# Altium schematic sheet Power Distribution - IO Expander.SchDoc: Title
size B; Organization: Midnight Sun Solar Rayce Car Team; Address1: University of Waterloo; Address2: 200 University Ave W; Address3: Waterloo, ON, Canada; Address4: N2L 3E9; Website: www.uwmidsun.com; ProjectName: ProjectName
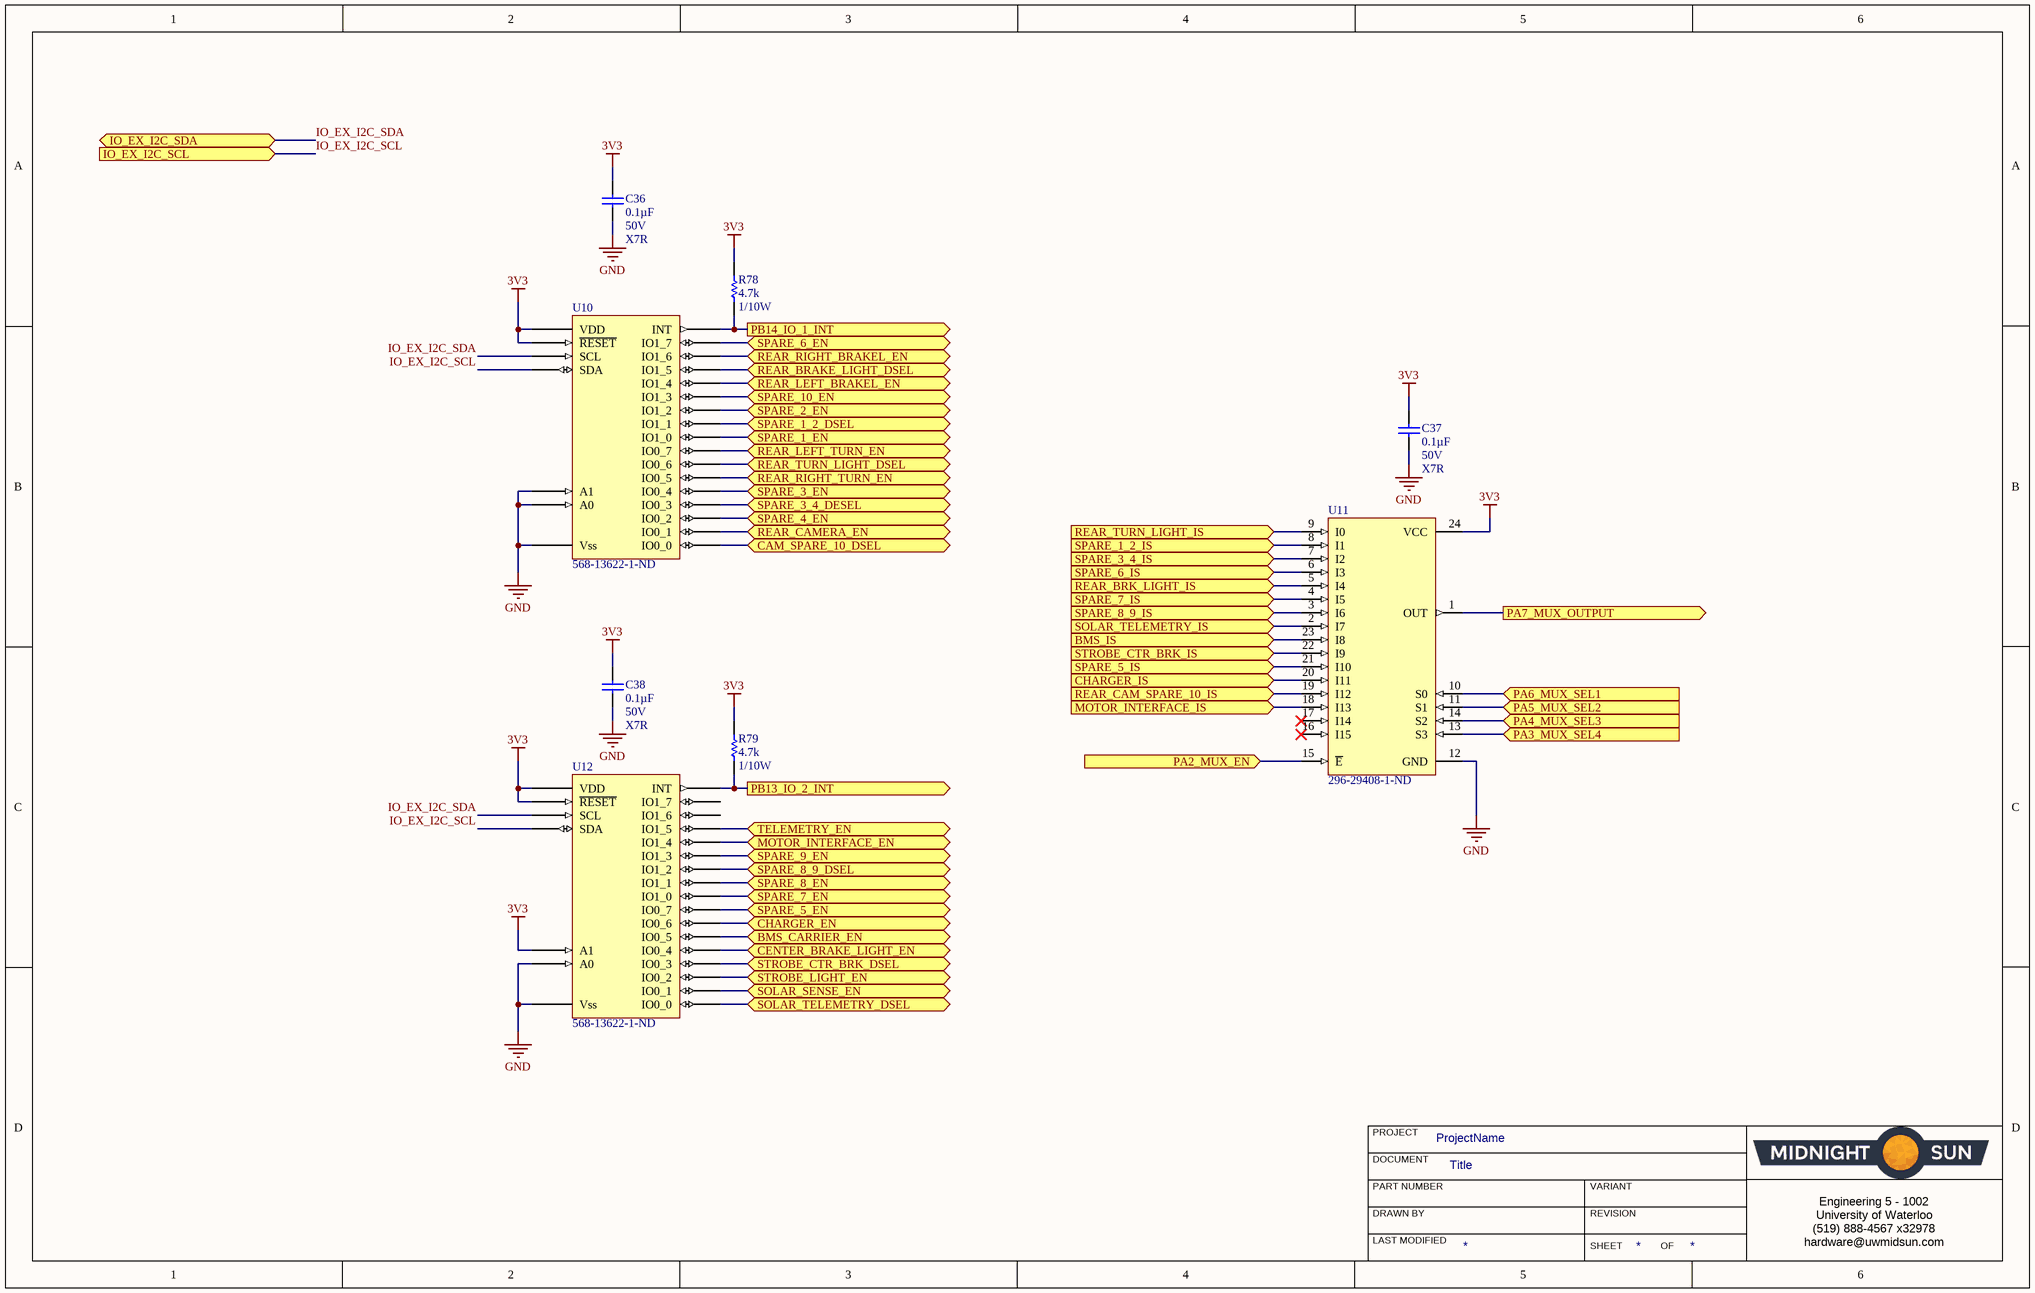
[diagram p0: Power Distribution - IO Expander.SchDoc]

## Parts
C36  Capacitance: 0.1µF  Voltage: 50V  Temperature Coefficient: X7R  [CAP, 0603]  (hidden comment: CAP CER 0.1UF 50V 10% X7R 0603)
C37  Capacitance: 0.1µF  Voltage: 50V  Temperature Coefficient: X7R  [CAP, 0603]  (hidden comment: CAP CER 0.1UF 50V 10% X7R 0603)
C38  Capacitance: 0.1µF  Voltage: 50V  Temperature Coefficient: X7R  [CAP, 0603]  (hidden comment: CAP CER 0.1UF 50V 10% X7R 0603)
R78  Resistance (Ohms): 4.7k  Power (Watts): 1/10W  [RES, 0603]  (hidden comment: RES 4.7K OHM 1% 1/10W 0603)
R79  Resistance (Ohms): 4.7k  Power (Watts): 1/10W  [RES, 0603]  (hidden comment: RES 4.7K OHM 1% 1/10W 0603)
U10  Supplier Part Number 1: 568-13622-1-ND  [SOP127P600-8N]  (hidden comment: 16-BIT I2C-BUS AND SMBUS LOW POW)
U11  Supplier Part Number 1: 296-29408-1-ND  [SOP127P1030X265-24N]  (hidden comment: IC MUX/DEMUX 1X16 24SSOP)
U12  Supplier Part Number 1: 568-13622-1-ND  [SOP127P600-8N]  (hidden comment: 16-BIT I2C-BUS AND SMBUS LOW POW)

## Ports
BMS_CARRIER_EN (bidir), BMS_IS (in), CAM_SPARE_10_DSEL (bidir), CENTER_BRAKE_LIGHT_EN (bidir), CHARGER_EN (bidir), CHARGER_IS (in), IO_EX_I2C_SCL (in), IO_EX_I2C_SDA (bidir), MOTOR_INTERFACE_EN (bidir), MOTOR_INTERFACE_IS (in), PA2_MUX_EN (in), PA3_MUX_SEL4 (in), PA4_MUX_SEL3 (in), PA5_MUX_SEL2 (in), PA6_MUX_SEL1 (in), PA7_MUX_OUTPUT (out), PB13_IO_2_INT (out), PB14_IO_1_INT (out), REAR_BRAKE_LIGHT_DSEL (bidir), REAR_BRK_LIGHT_IS (in), REAR_CAM_SPARE_10_IS (in), REAR_CAMERA_EN (bidir), REAR_LEFT_BRAKEL_EN (bidir), REAR_LEFT_TURN_EN (bidir), REAR_RIGHT_BRAKEL_EN (bidir), REAR_RIGHT_TURN_EN (bidir), REAR_TURN_LIGHT_DSEL (bidir), REAR_TURN_LIGHT_IS (in), SOLAR_SENSE_EN (bidir), SOLAR_TELEMETRY_DSEL (bidir), SOLAR_TELEMETRY_IS (in), SPARE_1_2_DSEL (bidir), SPARE_1_2_IS (in), SPARE_1_EN (bidir), SPARE_2_EN (bidir), SPARE_3_4_DESEL (bidir), SPARE_3_4_IS (in), SPARE_3_EN (bidir), SPARE_4_EN (bidir), SPARE_5_EN (bidir), SPARE_5_IS (in), SPARE_6_EN (bidir), SPARE_6_IS (in), SPARE_7_EN (bidir), SPARE_7_IS (in), SPARE_8_9_DSEL (bidir), SPARE_8_9_IS (in), SPARE_8_EN (bidir), SPARE_9_EN (bidir), SPARE_10_EN (bidir), STROBE_CTR_BRK_DSEL (bidir), STROBE_CTR_BRK_IS (in), STROBE_LIGHT_EN (bidir), TELEMETRY_EN (bidir)

## Nets
3V3: C36.1 C37.1 C38.1 R78.1 R79.1 U10.3(~{RESET}) U10.24(VDD) U11.24(VCC) U12.2(A1) U12.3(~{RESET}) U12.24(VDD)
GND: C36.2 C37.2 C38.2 U10.2(A1) U10.12(Vss) U10.21(A0) U11.12(GND) U12.12(Vss) U12.21(A0)
BMS_CARRIER_EN: U12.9(IO0_5) ; port BMS_CARRIER_EN
BMS_IS: U11.23(I8) ; port BMS_IS
CAM_SPARE_10_DSEL: U10.4(IO0_0) ; port CAM_SPARE_10_DSEL
CENTER_BRAKE_LIGHT_EN: U12.8(IO0_4) ; port CENTER_BRAKE_LIGHT_EN
CHARGER_EN: U12.10(IO0_6) ; port CHARGER_EN
CHARGER_IS: U11.20(I11) ; port CHARGER_IS
IO_EX_I2C_SCL: U10.23(SDA) U12.23(SDA) ; port IO_EX_I2C_SCL
IO_EX_I2C_SDA: U10.22(SCL) U12.22(SCL) ; port IO_EX_I2C_SDA
MOTOR_INTERFACE_EN: U12.17(IO1_4) ; port MOTOR_INTERFACE_EN
MOTOR_INTERFACE_IS: U11.18(I13) ; port MOTOR_INTERFACE_IS
PA2_MUX_EN: U11.15(~{E}) ; port PA2_MUX_EN
PA3_MUX_SEL4: U11.13(S3) ; port PA3_MUX_SEL4
PA4_MUX_SEL3: U11.14(S2) ; port PA4_MUX_SEL3
PA5_MUX_SEL2: U11.11(S1) ; port PA5_MUX_SEL2
PA6_MUX_SEL1: U11.10(S0) ; port PA6_MUX_SEL1
PA7_MUX_OUTPUT: U11.1(OUT) ; port PA7_MUX_OUTPUT
PB13_IO_2_INT: R79.2 U12.1(INT) ; port PB13_IO_2_INT
PB14_IO_1_INT: R78.2 U10.1(INT) ; port PB14_IO_1_INT
REAR_BRAKE_LIGHT_DSEL: U10.18(IO1_5) ; port REAR_BRAKE_LIGHT_DSEL
REAR_BRK_LIGHT_IS: U11.5(I4) ; port REAR_BRK_LIGHT_IS
REAR_CAM_SPARE_10_IS: U11.19(I12) ; port REAR_CAM_SPARE_10_IS
REAR_CAMERA_EN: U10.5(IO0_1) ; port REAR_CAMERA_EN
REAR_LEFT_BRAKEL_EN: U10.17(IO1_4) ; port REAR_LEFT_BRAKEL_EN
REAR_LEFT_TURN_EN: U10.11(IO0_7) ; port REAR_LEFT_TURN_EN
REAR_RIGHT_BRAKEL_EN: U10.19(IO1_6) ; port REAR_RIGHT_BRAKEL_EN
REAR_RIGHT_TURN_EN: U10.9(IO0_5) ; port REAR_RIGHT_TURN_EN
REAR_TURN_LIGHT_DSEL: U10.10(IO0_6) ; port REAR_TURN_LIGHT_DSEL
REAR_TURN_LIGHT_IS: U11.9(I0) ; port REAR_TURN_LIGHT_IS
SOLAR_SENSE_EN: U12.5(IO0_1) ; port SOLAR_SENSE_EN
SOLAR_TELEMETRY_DSEL: U12.4(IO0_0) ; port SOLAR_TELEMETRY_DSEL
SOLAR_TELEMETRY_IS: U11.2(I7) ; port SOLAR_TELEMETRY_IS
SPARE_1_2_DSEL: U10.14(IO1_1) ; port SPARE_1_2_DSEL
SPARE_1_2_IS: U11.8(I1) ; port SPARE_1_2_IS
SPARE_1_EN: U10.13(IO1_0) ; port SPARE_1_EN
SPARE_2_EN: U10.15(IO1_2) ; port SPARE_2_EN
SPARE_3_4_DESEL: U10.7(IO0_3) ; port SPARE_3_4_DESEL
SPARE_3_4_IS: U11.7(I2) ; port SPARE_3_4_IS
SPARE_3_EN: U10.8(IO0_4) ; port SPARE_3_EN
SPARE_4_EN: U10.6(IO0_2) ; port SPARE_4_EN
SPARE_5_EN: U12.11(IO0_7) ; port SPARE_5_EN
SPARE_5_IS: U11.21(I10) ; port SPARE_5_IS
SPARE_6_EN: U10.20(IO1_7) ; port SPARE_6_EN
SPARE_6_IS: U11.6(I3) ; port SPARE_6_IS
SPARE_7_EN: U12.13(IO1_0) ; port SPARE_7_EN
SPARE_7_IS: U11.4(I5) ; port SPARE_7_IS
SPARE_8_9_DSEL: U12.15(IO1_2) ; port SPARE_8_9_DSEL
SPARE_8_9_IS: U11.3(I6) ; port SPARE_8_9_IS
SPARE_8_EN: U12.14(IO1_1) ; port SPARE_8_EN
SPARE_9_EN: U12.16(IO1_3) ; port SPARE_9_EN
SPARE_10_EN: U10.16(IO1_3) ; port SPARE_10_EN
STROBE_CTR_BRK_DSEL: U12.7(IO0_3) ; port STROBE_CTR_BRK_DSEL
STROBE_CTR_BRK_IS: U11.22(I9) ; port STROBE_CTR_BRK_IS
STROBE_LIGHT_EN: U12.6(IO0_2) ; port STROBE_LIGHT_EN
TELEMETRY_EN: U12.18(IO1_5) ; port TELEMETRY_EN

Not connected (* = marked no-connect by the designer): U11 16(I15)* 17(I14)*; U12 19(IO1_6) 20(IO1_7)

## Notes on the sheet
- PROJECT
- DOCUMENT
- DRAWN BY
- LAST MODIFIED
- PART NUMBER
- REVISION
- SHEET
- VARIANT
- OF
- Engineering 5 - 1002
  University of Waterloo
  (519) 888-4567 x32978
  hardware@uwmidsun.com

## Library data of the parts
C36-C38 = CAP CER 0.1UF 50V 10% X7R 0603: 0.10µF ±10% 50V Ceramic Capacitor X7R 0603 (1608 Metric); Manufacturer 1: AVX Corporation; Manufacturer Part Number 1: 06035C104KAT2A; Supplier 1: Digi-Key; Supplier Part Number 1: 478-5052-1-ND; Packaging: Cut Tape (CT); Part Status: Active; Operating Temperature: -55°C ~ 125°C; Ratings: -; Mounting Type: Surface Mount, MLCC; Package / Case: 0603 (1608 Metric); Size / Dimension: 0.063" L x 0.032" W (1.60mm x 0.81mm); Height - Seated (Max): -; Thickness (Max): 0.035" (0.90mm); Lead Spacing: -; Lead Style: -; ComponentLink1URL: http://datasheets.avx.com/X7RDielectric.pdf; ComponentLink1Description: http://datasheets.avx.com/X7RDielectric.pdf; Tolerance: ±10%
R78 R79 = RES 4.7K OHM 1% 1/10W 0603: 4.7k Ohm ±1% 0.1W, 1/10W Chip Resistor 0603 (1608 Metric) Moisture Resistant Thick Film; Manufacturer 1: Yageo; Manufacturer Part Number 1: RC0603FR-074K7L; Description 1: RES SMD 4.7K OHM 1% 1/10W 0603; Temperature Coefficient: ±100ppm/°C; Supplier 1: Digi-Key; Supplier Part Number 1: 311-4.70KHRCT-ND; RoHS: RoHS Compliant; Category: Resistors; Stock 1: 3487566; Pricing 1: 1=0.16, 10=0.022, 100=0.0089, 1000=0.00402, 2500=0.00349 (CAD); Packaging: Cut Tape (CT); Part Status: Active; Composition: Thick Film; Features: Moisture Resistant; Operating Temperature: -55°C ~ 155°C; Package / Case: 0603 (1608 Metric); Supplier Device Package: 0603; Size / Dimension: 0.063" L x 0.031" W (1.60mm x 0.80mm); Height - Seated (Max): 0.022" (0.55mm); Failure Rate: -; ComponentLink1URL: http://www.yageo.com/documents/recent/PYu-RC_Group_51_RoHS_L_7.pdf; ComponentLink1Description: http://www.yageo.com/documents/recent/PYu-RC_Group_51_RoHS_L_7.pdf; Tolerance: ±1%
U10 U12 = 16-BIT I2C-BUS AND SMBUS LOW POW: I/O Expander 16 I²C, SMBus 400kHz 24-TSSOP; ComponentLink1Description: https://www.nxp.com/docs/en/data-sheet/PCA9539_PCA9539R.pdf; ComponentLink1URL: https://www.nxp.com/docs/en/data-sheet/PCA9539_PCA9539R.pdf; Supplier 1: Digi-Key
U11 = IC MUX/DEMUX 1X16 24SSOP: 1 Circuit IC Switch 16:1 160 Ohm 24-SOIC; Manufacturer: Texas Instruments; Manufacturer Part Number: CD74HC4067M96; Number of Channels: 1; Number of Inputs: 16; Max Supply Voltage: 6V; Min Supply Voltage: 2V; Bandwidth: 89MHz; Propagation Delay: 75ns; On-State Resistance: 180R; Turn-On Delay Time: 300ns; Turn-Off Delay Time: 290ns; Logic Function: Demultiplexer,Multiplexer; Operating Supply Current: 8uA; Supply Type: Single; Low Level Output Current: 25mA; ComponentLink1URL: http://www.ti.com/lit/ds/symlink/cd74hc4067.pdf; ComponentLink1Description: http://www.ti.com/lit/ds/symlink/cd74hc4067.pdf; Supplier 1: Digi-Key; Stock 1: 10305; Pricing 1: 1 = 0.80000, 10 = 0.70400, 100 = 0.53940, 500 = 0.42642, 1000 = 0.34114 (USD); RoHS: Yes; Mount: Surface Mount; Case/Package: SOIC; Number of Pins: 24; Weight: 0.022025oz; Contact Plating: Matte,Tin; Min Operating Temperature: -55°C; Max Operating Temperature: 125°C; Number of Outputs: 1; Packaging: Tape and Reel; Package Quantity: 2000; Number of Circuits: 1; Nominal Supply Current: 8uA; Number of Bits: 16; High Level Output Current: 25mA; Length: 15.4mm; Height: 2.35mm; Width: 7.52mm; Radiation Hardening: No; REACH SVHC: No SVHC; Lead Free: Lead Free; ComponentLink2URL: https://www.verical.com/server-webapp/html/getDatasheet?partID=322813&src-supplier=Verical; ComponentLink2Description: https://www.verical.com/server-webapp/html/getDatasheet?partID=322813&src-supplier=Verical; ComponentLink3URL: http://focus.ti.com/lit/ds/symlink/cd74hc4067.pdf?src-supplier=Avnet+Europe; ComponentLink3Description: http://focus.ti.com/lit/ds/symlink/cd74hc4067.pdf?src-supplier=Avnet+Europe; ComponentLink4URL: http://www.ti.com/lit/ds/symlink/cd74hc4067.pdf?src-supplier=Digi-Key; ComponentLink4Description: http://www.ti.com/lit/ds/symlink/cd74hc4067.pdf?src-supplier=Digi-Key